# EAGLE design LedBricksPlate2x6 (EAGLE 9.6.2)
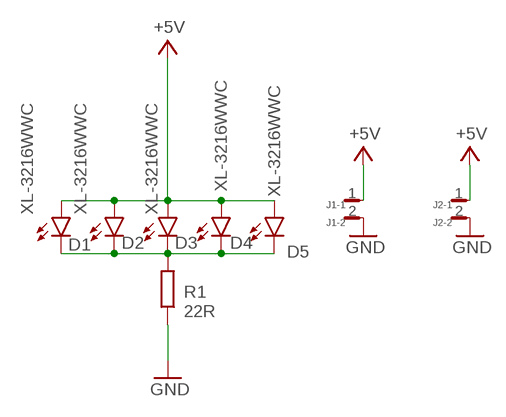
[diagram p0: schematic, sheet 1]

## Parts
D1  XL-3216WWC  LED1206  [LED-1206]
D2  XL-3216WWC  LED1206  [LED-1206]
D3  XL-3216WWC  LED1206  [LED-1206]
D4  XL-3216WWC  LED1206  [LED-1206]
D5  XL-3216WWC  LED1206  [LED-1206]
J1  SM02B-SRSS-TB  [SM02B-SRSS-TB]
J2  SM02B-SRSS-TB  [SM02B-SRSS-TB]
R1  22R  R-EU_R0805  [R0805]

## Nets
+5V: D1.A D2.A D3.A D4.A D5.A J1.1 J2.1
GND: J1.2 J2.2 R1.1
N$2: D1.C D2.C D3.C D4.C D5.C R1.2
Unconnected: J1.M1 J1.M2 J2.M1 J2.M2

## Library data of the parts
D1-D5 = SparkFun-LED:LED: LED (Generic) Standard schematic elements and footprints for 5mm, 3mm, 1206, and 0603 sized LEDs. Generic LEDs with no color specified.
J1 J2 = con-JST-SH:SM02B-SRSS-TB; MF: JST; MPN: SM02B-SRSS-TB
R1 = resistor:R-EU_: RESISTOR, European symbol

## Board
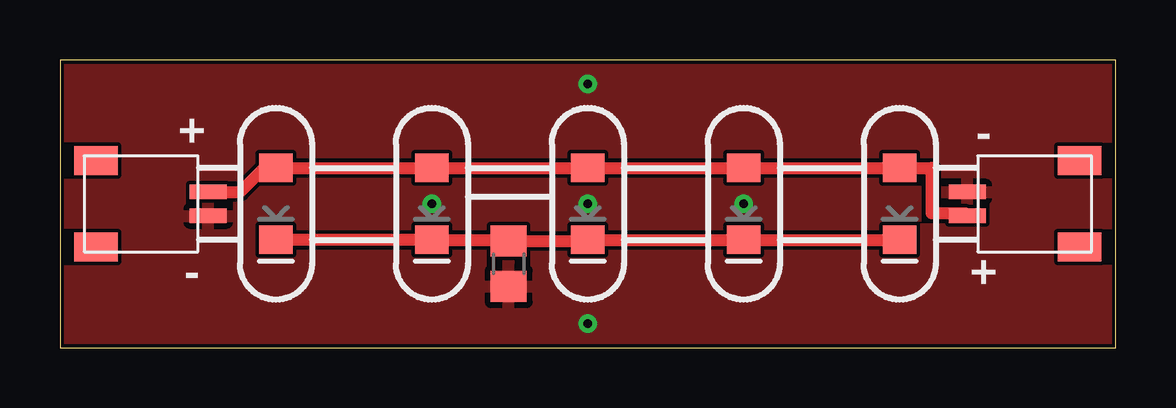
[diagram p1: board, top side]
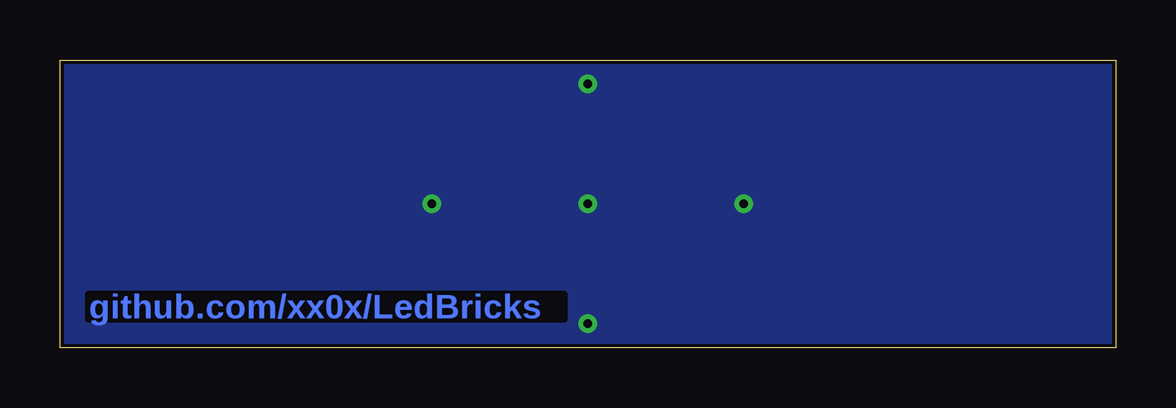
[diagram p2: board, bottom side, seen from below]

Size 44 x 12 mm. Coordinates in mm from the lower left corner, seen from the top.
Outline: 0,0 44,0 44,12 0,12 0,0
Copper layers (1*16): Top 0.035mm / dielectric 1.5mm / Bottom 0.035mm
Design rules "default_tenting_vias": minimum track width 6mil, minimum drill 0.35mm, track to track 6mil, track to pad 6mil, pad to pad 6mil, via to via 6mil, smd to smd 6mil, copper to edge 6mil, drill to drill 6mil, minimum pad ring 10mil, minimum via ring 8mil, stop-mask expansion 4mil, vias tented up to drill 20mil, thermal gap 10mil

### Footprints (pad centres in the part's own frame; a part is rotated, then mirrored left to right if it is on the bottom)
LED-1206 = smd 1.2 x 1.4: A -1.5,0; C 1.5,0
SM02B-SRSS-TB = smd 0.6 x 1.55: 1 -0.5,4.675; 2 0.5,4.675 | smd 1.2 x 1.8: M1 1.8,0; M2 -1.8,0
R0805 = smd 1.3 x 1.5: 1 -0.95,0; 2 0.95,0

### Placement (x,y rotation side)
D1  9,6 270 top
D2  15.5,6 270 top
D3  22,6 270 top
D4  28.5,6 270 top
D5  35,6 270 top
J1  1.5,6 270 top
J2  42.5,6 90 top
R1  18.7,3.5 90 top

### Tracks (layer width: path | path; a pad name or v marks a point on that pad's centre or on a via)
+5V
  Top 0.508: J1.1 7.5,6.5 8.5,7.5 D1.A D2.A D3.A D4.A D5.A 36.33,7.5 36.33,5.6 37.73,5.6 J2.1
GND  (via drill 0.35)
  other vias: 15.5,6 22,6 28.5,6 22,1 22,11
  pour Top: -1,13 45,13 45,-1 -1,-1
  pour Bottom: -0.5,12.5 44.5,12.5 44.5,-0.5 -0.5,-0.5
N$2
  Top 0.508: D1.C D2.C 18.65,4.5 R1.2 21.95,4.45 D3.C D4.C D5.C

### Text on the board
Bottom: github.com/xx0x/LedBricks
tPlace: + | - | - | +